# Altium project Decibel Meter.PrjPcb
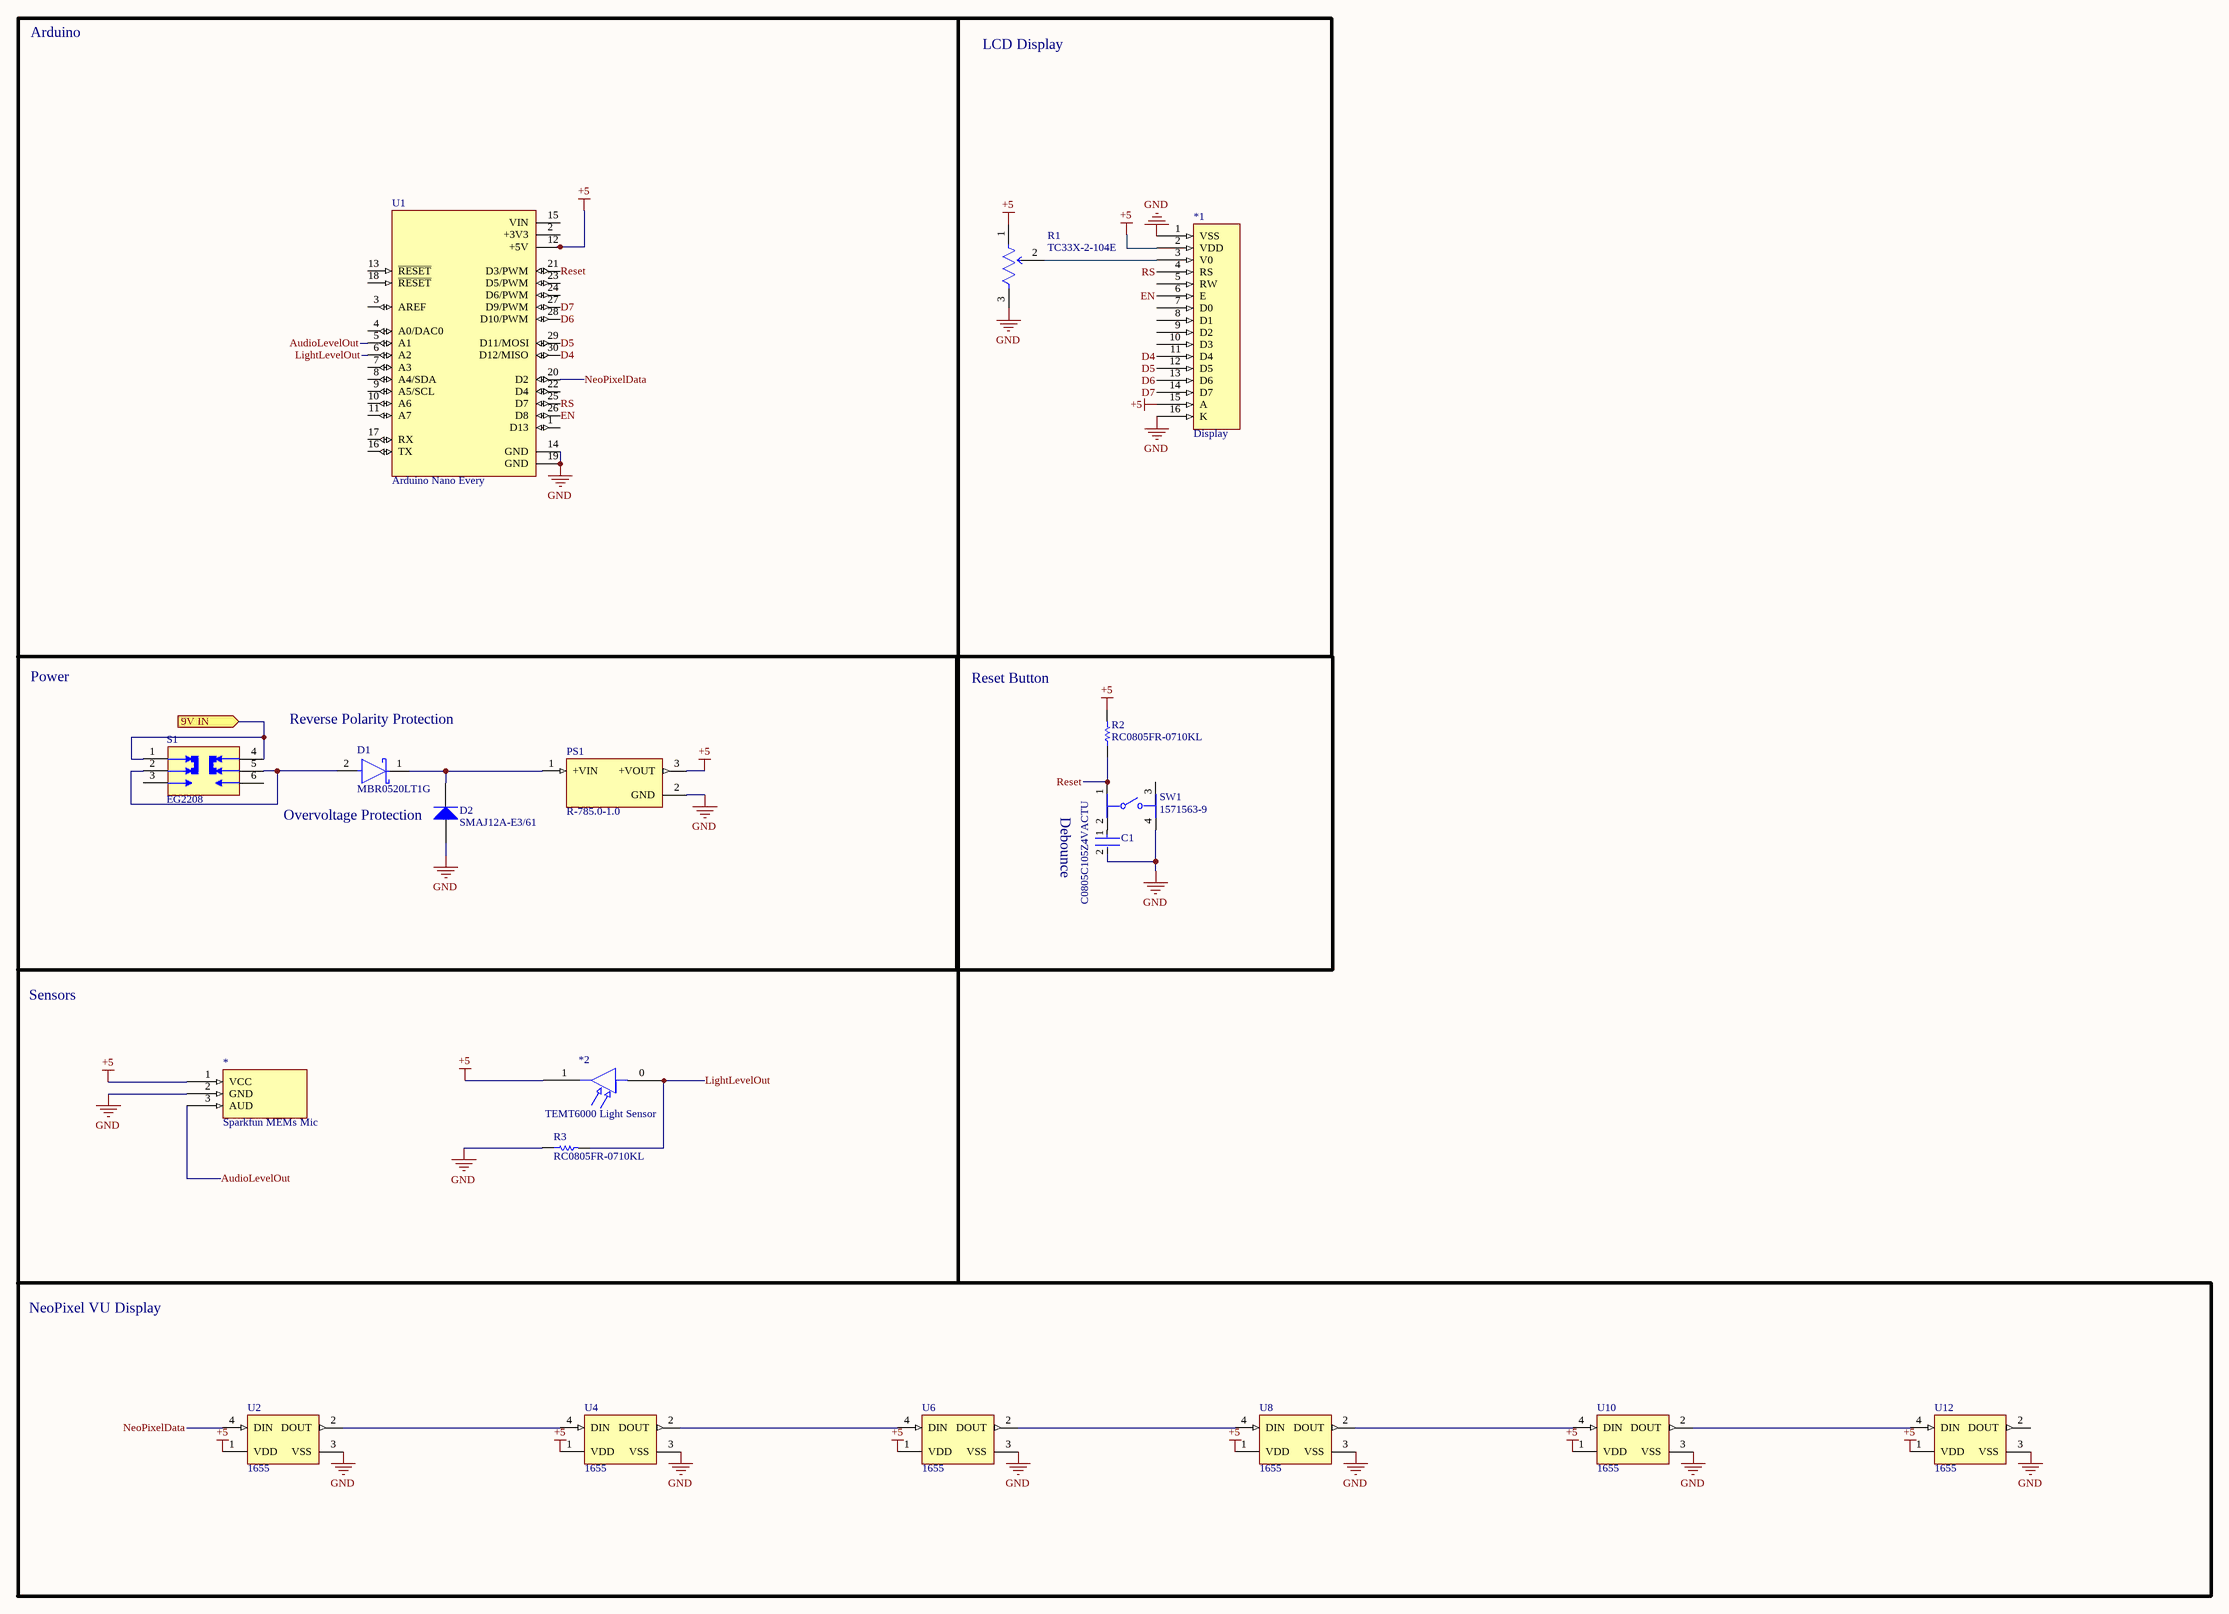
[diagram p0: DBMSch.SchDoc]
1 sheet, 19 parts. Net scope: flat (ports and power ports of the same name join across sheets).
Board file: DBMPCB.PcbDoc

## Sheet DBMSch.SchDoc
size C; SheetNumber: 1; SheetTotal: 1

### Parts
*  Sparkfun MEMs Mic  [MEMs Mic Board]
*1  Display  [Screen]
*2  TEMT6000 Light Sensor  [Light Sensor]
C1  C0805C105Z4VACTU  [FP-C0805C105Z4VACTU-MFG]
D1  MBR0520LT1G  [FP-425-04-IPC_C]
D2  SMAJ12A-E3/61  [VISH-DO-214AC-2_N]
PS1  R-785.0-1.0  [CONV_R-785.0-1.0]
R1  TC33X-2-104E  [FP-TC33X-2-MFG]
R2  RC0805FR-0710KL  [RESC2013X60X35NL10T20]
R3  RC0805FR-0710KL  [RESC2013X60X35NL10T20]
S1  EG2208  [SW_EG2208]
SW1  1571563-9  [FP-1571563-9-MFG]
U1  Arduino Nano Every  [MODULE_ABX00028]
U2  1655  [ADA-RGB-1655_V]
U4  1655  [ADA-RGB-1655_V]
U6  1655  [ADA-RGB-1655_V]
U8  1655  [ADA-RGB-1655_V]
U10  1655  [ADA-RGB-1655_V]
U12  1655  [ADA-RGB-1655_V]

### Blocks framed on the sheet
Arduino: U1
LCD Display: *1 R1
Sensors: * *2 R3
NeoPixel VU Display: U2 U4 U6 U8 U10 U12

### Ports
9V IN (in)

### Nets
+5: *.1(VCC) *1.2(VDD) *1.15(A) *2.1 PS1.3(+VOUT) R1.1(CCW) R2.2 U1.12(+5V) U2.1(VDD) U4.1(VDD) U6.1(VDD) U8.1(VDD) U10.1(VDD) U12.1(VDD)
GND: *.2(GND) *1.1(VSS) *1.16(K) C1.2 D2.2(A) PS1.2(GND) R1.3(CW) R3.1 SW1.4 U1.14(GND) U1.19(GND) U2.3(VSS) U4.3(VSS) U6.3(VSS) U8.3(VSS) U10.3(VSS) U12.3(VSS)
AudioLevelOut: *.3(AUD) U1.5(A1)
D4: *1.11(D4) U1.30(D12/MISO)
D5: *1.12(D5) U1.29(D11/MOSI)
D6: *1.13(D6) U1.28(D10/PWM)
D7: *1.14(D7) U1.27(D9/PWM)
EN: *1.6(E) U1.26(D8)
LightLevelOut: *2.0 R3.2 U1.6(A2)
NeoPixelData: U1.20(D2) U2.4(DIN)
Reset: R2.1 SW1.1 U1.21(D3/PWM)
RS: *1.4(RS) U1.25(D7)
Net*1_3: *1.3(V0) R1.2(WIPER)
NetC1_1: C1.1 SW1.2
NetD1_1: D1.1(C) D2.1(K) PS1.1(+VIN)
NetD1_2: D1.2(A) S1.2 S1.5
NetS1_1: S1.1 S1.4 ; port 9V IN
NetU2_2: U2.2(DOUT) U4.4(DIN)
NetU4_2: U4.2(DOUT) U6.4(DIN)
NetU6_2: U6.2(DOUT) U8.4(DIN)
NetU8_2: U8.2(DOUT) U10.4(DIN)
NetU10_2: U10.2(DOUT) U12.4(DIN)

Not connected (* = marked no-connect by the designer): *1 5(RW) 7(D0) 8(D1) 9(D2) 10(D3); S1 3 6; SW1 3; U1 1(D13) 2(+3V3) 3(AREF) 4(A0/DAC0) 7(A3) 8(A4/SDA) 9(A5/SCL) 10(A6) 11(A7) 13(~{RESET}) 15(VIN) 16(TX) 17(RX) 18(~{RESET}) 22(D4) 23(D5/PWM) 24(D6/PWM); U12 2(DOUT)

### Notes on the sheet
- Power
- Reverse Polarity Protection
- Reset Button
- (near D2) Overvoltage Protection
- Debounce

### Library data of the parts
*2 = Light Sensor
C1 = CMP-2007-03241-2: CAP CER 1UF 16V Y5V 0805; Tolerance: 80%; Dielectric Material: Ceramic; Dissipation Factor: 7%; Depth: 1.25mm; Voltage: 16V; Dielectric: Y5V; Max Operating Temperature: 85°C; REACH SVHC: No SVHC; Thickness: 0.055inch; Capacitance: 1uF; Case Code (Imperial): 0805; Case/Package: 0805; Height: 1.25mm; Contact Material: Tin; Radiation Hardening: No; Min Operating Temperature: -30°C; Length: 2mm; Lead Free: Lead Free; Case Code (Metric): 2012; Packaging: Tape and Reel; Number of Pins: 2; Series: C; RoHS Compliant: Yes; Termination: SMD/SMT; Mount: Surface Mount; Lead Pitch: 0.75mm; Voltage Rating: 16V; Package Quantity: 1; Voltage Rating (DC): 16V; Construction: Flat; Width: 0.049inch
D1 = CMP-1055-00425-2: DIODE SCHOTTKY 20V 500MA SOD123; Polarity: Standard; Peak Non-Repetitive Surge Current: 5.5A; Forward Voltage: 385mV; Element Configuration: Single; Peak Reverse Current: 250uA; Max Repetitive Reverse Voltage (Vrrm): 20V; Voltage Rating (DC): 20V; Case/Package: SOD-123-2; Number of Pins: 2; Output Current: 500mA; Min Operating Temperature: -65°C; Lead Free: Lead Free; REACH SVHC: No SVHC; Max Reverse Voltage (DC): 20V; Termination: SMD/SMT; Average Rectified Current: 500mA; Max Surge Current: 5.5A; Package Quantity: 3000; Height: 1.12mm; Current Rating: 500mA; Forward Current: 500mA; Max Forward Surge Current (Ifsm): 5.5A; Packaging: Tape and Reel; Length: 2.69mm; Radiation Hardening: No; Max Reverse Leakage Current: 250uA; Width: 1.6mm; Contact Plating: Tin; Max Operating Temperature: 125°C
D2 = CMP-0544-00020-2: Transient Voltage Suppressor, 6.40 to 231 V, 12 V Stand-off Voltage, Uni-Directional, -55 to 155 degC, 2-pin DO-214AC, Pb-Free, Tape and Reel; Manufacturer: Vishay Semiconductor; PPPM (W): 400, 300; IFSM: 40 A; ID (uA): 1; VBR Uni-Directional (V): 6.4 to 231; VWM (V): 12; Packing: Tape and Reel; RoHS: TRUE; ComponentLink2Description: Datasheet; Operating Junction and Storage Temperature Range: -55 to 150 degC; PackageReference: DO-214AC-2; Mounting Technology: Surface Mount; DatasheetVersion: 12/8/2013; PackageDescription: 2-Pin DO-214AC (SMA), Body 4.245 x 2.665 mm; ComponentLink3URL: http://www.vishay.com/docs/88390/smaj50a.pdf; ComponentLink1URL: http://www.vishay.com/; ComponentLink1Description: Manufacturer URL; ComponentLink3Description: Package Specification; PartNumber: SMAJ12A-E3/61; ComponentLink2URL: http://www.vishay.com/docs/88390/smaj50a.pdf
PS1 = R-785.0-1.0: 1.0 Amp SIP3 Single Output; MF: {'manufacturer': u'Recom Power'}; MP: R-785.0-1.0; Value: *; Price: None; Package: None; Availability: Unavailable
R1 = CMP-07234-000040-1: TRIMMER 100K OHM 0.1W J LEAD TOP; Number of Turns: 1; Voltage Rating (DC): 50V; Power Rating: 100mW; Resistance Tolerance: 25%; Resistance: 100kR; Temperature Coefficient: 250ppm/°C; Max Operating Temperature: 100°C; Package Quantity: 2500; REACH SVHC: No SVHC; Termination: Foot Print; Packaging: Tape and Reel; RoHS Compliant: Yes; Military Standard: Not; Color: Silver; Width: 0.118inch; Min Operating Temperature: -40°C; Mount: Surface Mount; Height: 0.047inch; Tolerance: 25%; Resistor Type: Carbon; Length: 3mm; Depth: 3.8mm; Weight: 29.4mg; Max Power Dissipation: 100mW; Series: TC33; Radiation Hardening: No
R2 R3 = CMP-1659-00013-4: Chip Resistor, 10 KOhm, +/- 1%, 0.125 W, -55 to 155 degC, 0805 (2012 Metric), RoHS, Tape and Reel; Manufacturer: Yageo; Voltage Rating: 150 V; Mount: Surface Mount; ComponentLink1Description: Manufacturer URL; ComponentLink2URL: http://www.yageo.com/documents/recent/PYu-RC_Group_51_RoHS_L_04.pdf; Pins: 2; Length: 2 mm; Min Operating Temperature: -55 degC; Height: 0.5 mm; Mounting Technology: Surface Mount; RoHSCompliant: true; REACH SVHC: No SVHC; ComponentLink1URL: http://www.yageo.com/; Max Operating Temperature: 155 degC; PackageReference: 0805; DatasheetVersion: Rev. 4, 02/2016; Package Quantity: 5000; Packaging: Tape and Reel; ComponentLink2Description: Datasheet; PackageDescription: 2-Pin Surface Mounted Device, Body 2 x 1.25 mm
S1 = EG2208: MF: {'manufacturer': u'E-Switch'}; Value: *; Package: None; Availability: Unavailable; Price: None; MP: EG2208
SW1 = CMP-03402-000005-1: SWITCH TACTILE SPST-NO 0.05A 24V; Manufacturer: TE Connectivity; Standoff Height: 0.05mm; Electromechanical Life: 100000Cycles; Contact Resistance: 100mΩ; Operating Force: 160gf; Contact Current Rating: 50mA; Automotive: No; Device Class L1: Electromechanical; Voltage Rating Dc: 24V; ComponentLink2Description: Datasheet; Mount: Surface Mount; RoHS: TRUE; Temperature: -35°C to +85°C; ComponentLink2URL: https://www.te.com/commerce/DocumentDelivery/DDEController?Action=showdoc&DocId=Customer+Drawing%7F2-1437565-7%7FV%7Fpdf%7FEnglish%7FENG_CD_2-1437565-7_V.pdf%7F1571563-9; Manufacturer Part Number: 1571563-9; Temperature Range Low: -35°C; Lead Free: Yes; Device Class L2: Switches; Package: SMT_SW_6MM0_6MM0; Octopart: https://octopart.com/1571563-9-te+connectivity-41253969; Throw Configuration: SPST-NO; Mouser Description: Tactile Switches SPST OFF(ON) RND SMT MINI PB TACT SWITCH; Temperature Range High: +85°C; Digikey Description: SWITCH TACTILE SPST-NO 0.05A 24V; Device Class L3: Pushbutton Switches; Category: Switch; Height: 9.75mm
U1 = ABX00028: ATmega4809 Arduino Nano Every AVR AVR MCU 8-Bit Embedded Evaluation Board; MF: {'manufacturer': u'Arduino'}; Package: None; MP: ABX00028; Value: *; Price: None; Availability: Unavailable
U2 U4 U6 U8 U10 U12 = CMP-2000-05026-1: Intelligent Control LED Integrated Light Source, 3.5 to 5.3 V, -25 to 80 degC, 4-Pin SMD, RoHS, Tape and Reel; Manufacturer: Adafruit-Industries-LLC; Number of LEDs: 10; Configuration: Discrete; Utilized LED: WS2812(5050); Datasheet URL: http://datasheet.octopart.com/ADA1655-Adafruit-Industries-datasheet-32028139.pdf; Series: Neopixel; Interface: -; Package Description: 4-Pin Surface Mount Device, Body 5 x 5 mm; Color: Red,Green,Blue(RGB); Category: Optoelectronics; Controller Type: -; Package Reference: 1655; Manufacturer URL: https://www.adafruit.com/; Mounting Type: SurfaceMount; Datasheet Version: May-13; Size / Dimension: 5.00mmLx5.00mmW; Family: Addressable,Specialty